# Altium schematic sheet Sheet1.SchDoc
size B; DocumentNumber: 1; SheetNumber: 1; SheetTotal: 3
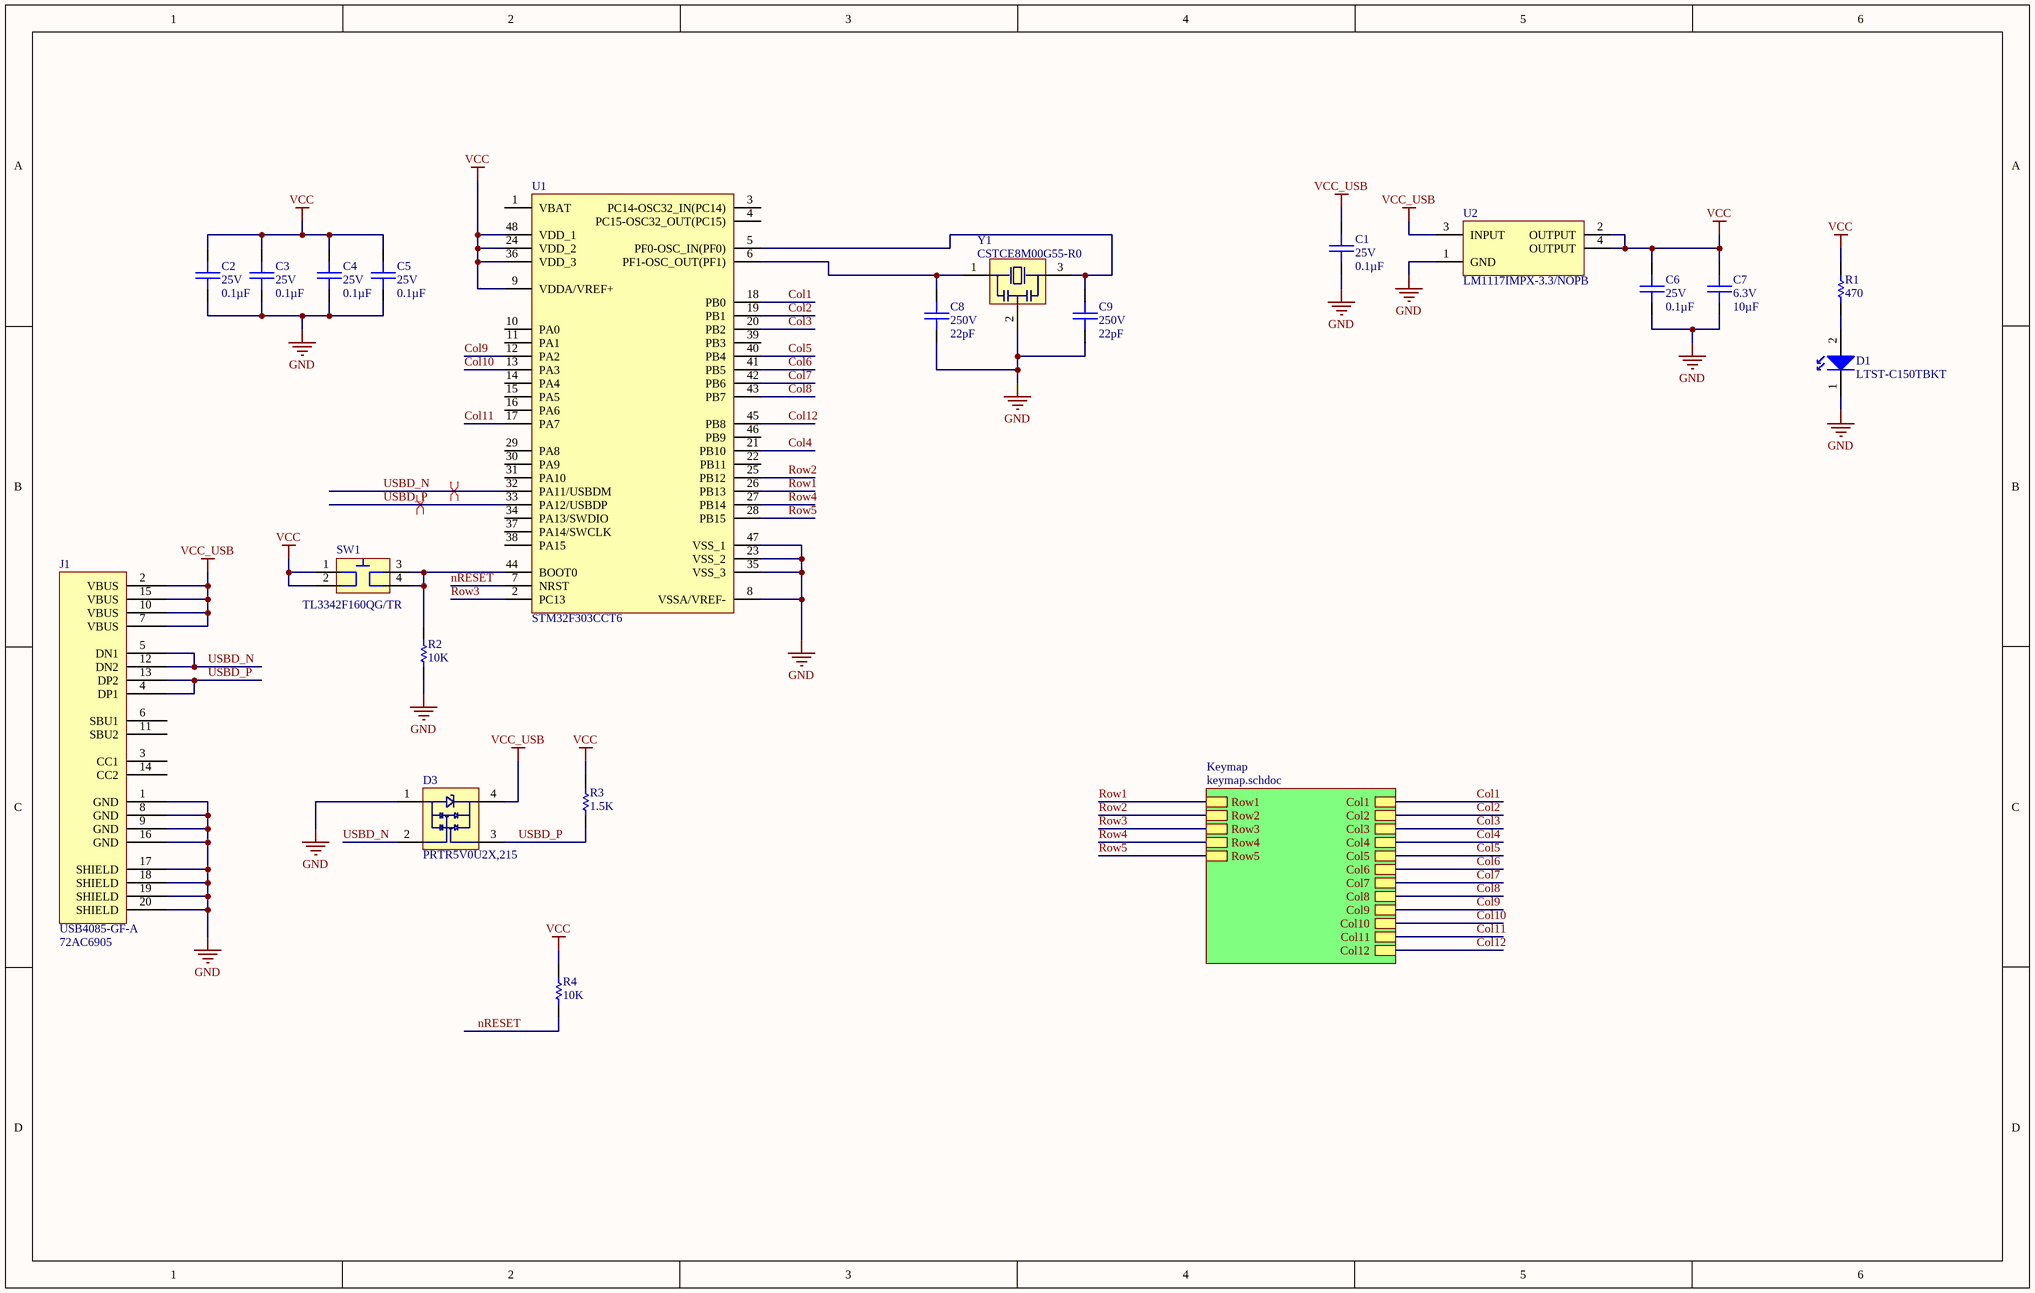
[diagram p0: Sheet1.SchDoc]

## Parts
C1  value 0.1µF  Voltage: 25V  [CAPC_0603(1.6X0.8)_N]  (hidden comment: Generic CAPC 0603 0.1µF 25V ±10% X7R)
C2  value 0.1µF  Voltage: 25V  [CAPC_0603(1.6X0.8)_N]  (hidden comment: Generic CAPC 0603 0.1µF 25V ±10% X7R)
C3  value 0.1µF  Voltage: 25V  [CAPC_0603(1.6X0.8)_N]  (hidden comment: Generic CAPC 0603 0.1µF 25V ±10% X7R)
C4  value 0.1µF  Voltage: 25V  [CAPC_0603(1.6X0.8)_N]  (hidden comment: Generic CAPC 0603 0.1µF 25V ±10% X7R)
C5  value 0.1µF  Voltage: 25V  [CAPC_0603(1.6X0.8)_N]  (hidden comment: Generic CAPC 0603 0.1µF 25V ±10% X7R)
C6  value 0.1µF  Voltage: 25V  [CAPC_0603(1.6X0.8)_N]  (hidden comment: Generic CAPC 0603 0.1µF 25V ±10% X7R)
C7  value 10µF  Voltage: 6.3V  [CAPC_0603(1.6X0.8)_N]  (hidden comment: Generic CAPC 0603 10µF 6.3V ±20% X5R)
C8  value 22pF  Voltage: 250V  [CAPC_0603(1.6X0.8)_N]  (hidden comment: Generic CAPC 0603 22pF 250V ±2% C0G/NP0)
C9  value 22pF  Voltage: 250V  [CAPC_0603(1.6X0.8)_N]  (hidden comment: Generic CAPC 0603 22pF 250V ±2% C0G/NP0)
D1  LED 468NM BLUE CLEAR 1206 SMD  [LTST-C150TBKT_N]  (value not drawn)
D3  TVS DIODE 5.5VWM SOT143B  [NXP_SOT143B_N]  (value not drawn)
J1  USB4085-GF-A  Supplier Part Number 1: 72AC6905  [GCT_USB4085-GF-A_MN]
R1  value 470  [RESC_0603(1.6X0.8)_N]  (hidden comment: Generic RES 0603 470 0.1W 5%)
R2  value 10K  [RESC_0603(1.6X0.8)_N]  (hidden comment: Generic RES 0603 10K 0.1W 5%)
R3  value 1.5K  [RESC_0603(1.6X0.8)_N]  (hidden comment: Generic RES 0603 1.5K 0.1W 5%)
R4  value 10K  [RESC_0603(1.6X0.8)_N]  (hidden comment: Generic RES 0603 10K 0.1W 5%)
SW1  Manufacturer Part Number: TL3342F160QG/TR  [TL3342F160QG-TR]  (hidden comment: SWITCH TACTILE SPST-NO 0.05A 12V)
U1  32BIT, CORTEX-M4, 72MHZ, LQFP-48  [ST_LQFP-48-7x7x1.4_MN]  (value not drawn)
U2  Manufacturer Part Number: LM1117IMPX-3.3/NOPB  [TI_DCY-R-PDSO-G4_N]  (hidden comment: IC REG LDO 3.3V 0.8A SOT223)
Y1  CER RESONATOR 8.00MHZ SMD  [CSTCE8M00G55-R0]  (value not drawn)

## Sub-sheets
Keymap = keymap.schdoc: Col3, Col7, Col10, Col1, Col9, Col11, Row5, Col2, Col4, Col12, Col5, Col6, Row1, Row3, Row2, Row4, Col8

## Nets
GND: C1.2 C2.2 C3.2 C4.2 C5.2 C6.2 C7.2 C8.2 C9.2 D1.1(K) D3.1(GND) J1.1(GND) J1.8(GND) J1.9(GND) J1.16(GND) J1.17(SHIELD) J1.18(SHIELD) J1.19(SHIELD) J1.20(SHIELD) R2.1 U1.8(VSSA/VREF-) U1.23(VSS_2) U1.35(VSS_3) U1.47(VSS_1) U2.1(GND) Y1.2
VCC: C2.1 C3.1 C4.1 C5.1 C6.1 C7.1 R1.2 R3.2 R4.2 SW1.1 SW1.2 U1.9(VDDA/VREF+) U1.24(VDD_2) U1.36(VDD_3) U1.48(VDD_1) U2.2(OUTPUT) U2.4(OUTPUT)
VCC_USB: C1.1 D3.4(VCC) J1.2(VBUS) J1.7(VBUS) J1.10(VBUS) J1.15(VBUS) U2.3(INPUT)
Col1: U1.18(PB0) ; sheet Keymap/Col1
Col2: U1.19(PB1) ; sheet Keymap/Col2
Col3: U1.20(PB2) ; sheet Keymap/Col3
Col4: U1.21(PB10) ; sheet Keymap/Col4
Col5: U1.40(PB4) ; sheet Keymap/Col5
Col6: U1.41(PB5) ; sheet Keymap/Col6
Col7: U1.42(PB6) ; sheet Keymap/Col7
Col8: U1.43(PB7) ; sheet Keymap/Col8
Col9: U1.12(PA2) ; sheet Keymap/Col9
Col10: U1.13(PA3) ; sheet Keymap/Col10
Col11: U1.17(PA7) ; sheet Keymap/Col11
Col12: U1.45(PB8) ; sheet Keymap/Col12
nRESET: R4.1 U1.7(NRST)
Row1: U1.26(PB13) ; sheet Keymap/Row1
Row2: U1.25(PB12) ; sheet Keymap/Row2
Row3: U1.2(PC13) ; sheet Keymap/Row3
Row4: U1.27(PB14) ; sheet Keymap/Row4
Row5: U1.28(PB15) ; sheet Keymap/Row5
USBD_N: D3.2(IO1) J1.5(DN1) J1.12(DN2) U1.32(PA11/USBDM)
USBD_P: D3.3(IO2) J1.4(DP1) J1.13(DP2) R3.1 U1.33(PA12/USBDP)
NetC8_1: C8.1 U1.6(PF1-OSC_OUT(PF1)) Y1.1
NetC9_1: C9.1 U1.5(PF0-OSC_IN(PF0)) Y1.3
NetD1_2: D1.2(A) R1.1
NetR2_2: R2.2 SW1.3 SW1.4 U1.44(BOOT0)

Not connected (* = marked no-connect by the designer): J1 3(CC1) 6(SBU1) 11(SBU2) 14(CC2); U1 1(VBAT) 3(PC14-OSC32_IN(PC14)) 4(PC15-OSC32_OUT(PC15)) 10(PA0) 11(PA1) 14(PA4) 15(PA5) 16(PA6) 22(PB11) 29(PA8) 30(PA9) 31(PA10) 34(PA13/SWDIO) 37(PA14/SWCLK) 38(PA15) 39(PB3) 46(PB9)

## Layout directives
differential pair: USBD_N, USBD_P

## Library data of the parts
C1-C6 = SFE-CAPC-0603-0.1µF-25V-±10%-X7R: Generic Capacitor; Case-IEC: 0603; capacitance: 0.0000001; Case-Metric: *; Tolerance: ±10%; DesignID: SFE-CAPC-0603-0.1µF-25V-±10%-X7R; Manufacturer: Generic; Manufacturer Part Number: SFE-CAPC-0603-0.1µF-25V-±10%-X7R
C7 = SFE-CAPC-0603-10µF-6.3V-±20%-X5R: Generic Capacitor; Case-IEC: 0603; capacitance: 0.00001; Case-Metric: *; Tolerance: ±20%; DesignID: SFE-CAPC-0603-10µF-6.3V-±20%-X5R; Manufacturer: Generic; Manufacturer Part Number: SFE-CAPC-0603-10µF-6.3V-±20%-X5R
C8 C9 = SFE-CAPC-0603-22pF-250V-±2%-C0G/NP0: Generic Capacitor; Case-IEC: 0603; capacitance: 0.000000000022; Case-Metric: *; Tolerance: ±2%; DesignID: SFE-CAPC-0603-22pF-250V-±2%-C0G/NP0; Manufacturer: Generic; Manufacturer Part Number: SFE-CAPC-0603-22pF-250V-±2%-C0G/NP0
D1 = LTST-C150TBKT: Manufacturer: Lite-On Inc; SafariPartNumber: 15 25012RC; Wavelength - Dominant: 470nm; Millicandela Rating: 104mcd; Voltage - Forward (Vf) (Typ): 3.3V; Current - Test: 20mA; Viewing Angle: 130°; Lens Style/Size: Rectangle with Flat Top, 2.06mm x 1.6mm; Supplier 1: Digi-Key; Supplier Part Number 1: 160-1643-1-ND; RoHS: RoHS Compliant; Category: Optoelectronics; Stock 1: 267579; Pricing 1: 1=0.5, 10=0.369, 100=0.1956, 250=0.13836, 500=0.11808, 1000=0.09225 (USD); Packaging: Cut Tape (CT); Color: Blue; Wavelength - Peak: 468nm; Lens Type: Clear; Package / Case: 1206 (3216 Metric); Size / Dimension: 3.20mm L x 1.60mm W; Height: 1.10mm; Mounting Type: Surface Mount; Luminous Flux @ Current - Test: -; ComponentLink1URL: http://optoelectronics.liteon.com/upload/download/DS22-2000-026/S_110_LTST-C150TBKT(0630).pdf; ComponentLink1Description: http://optoelectronics.liteon.com/upload/download/DS22-2000-026/S_110_LTST-C150TBKT(0630).pdf; Manufacturer Part Number: LTST-C150TBKT; DesignID: LTST-C150TBKT
D3 = PRTR5V0U2X,215: Manufacturer: NXP Semiconductors; SafariPartNumber: 15 27314RC; Type: Steering (Rail to Rail); Bidirectional Channels: 2; Voltage - Reverse Standoff (Typ): 5.5V (Max); Voltage - Breakdown (Min): 6V; Power Line Protection: Yes; Capacitance @ Frequency: 1pF @ 1MHz; Supplier 1: Digi-Key; Supplier Part Number 1: 568-4140-1-ND; RoHS: RoHS Compliant; Category: Circuit Protection; Stock 1: 19762; Pricing 1: 1=0.57, 10=0.477, 25=0.418, 100=0.3578, 250=0.31036, 500=0.26286, 1000=0.20265 (USD); Packaging: Cut Tape (CT); Unidirectional Channels: -; Voltage - Clamping (Max) @ Ipp: -; Current - Peak Pulse (10/1000µs): -; Power - Peak Pulse: -; Applications: General Purpose; Operating Temperature: -40°C ~ 85°C (TA); Mounting Type: Surface Mount; Package / Case: TO-253-4, TO-253AA; Supplier Device Package: SOT-143B; ComponentLink1URL: https://assets.nexperia.com/documents/data-sheet/PRTR5V0U2X.pdf; ComponentLink1Description: Datasheet; Manufacturer Part Number: PRTR5V0U2X,215; DesignID: PRTR5V0U2X,215
J1 = USB4085-GF-A: USB4085 Series 20 V PCB Top Mount USB 2.0 Type C Receptacle; Manufacturer 1: Global Connector Technology; USB Standard: USB 2.0; Number of Positions: 16; Supplier 1: Newark; Manufacturer Part Number 1: USB4085-GF-A; RoHS: No; Pricing 1: 1=1.38000, 10=1.23000, 25=1.15000, 50=1.06000, 100=0.91100, 250=0.83700, 700=0.77300, 1400=0.72600 (USD); Contact Material: Copper Alloy; Contact Plating: Gold; Gender: Receptacle; Orientation: Right Angle; ComponentLink1URL: https://datasheet.ciiva.com/71788/2674755-71788146.pdf?src-supplier=Element14; ComponentLink1Description: https://datasheet.ciiva.com/71788/2674755-71788146.pdf?src-supplier=Element14; ComponentLink2URL: https://datasheet.ciiva.com/71788/usb4085-71788147.pdf?src-supplier=Digi-Key; ComponentLink2Description: https://datasheet.ciiva.com/71788/usb4085-71788147.pdf?src-supplier=Digi-Key
R1 = SFE-RES-0603-470-0.1W-5%: Generic Resistor; Temperature Coefficient: PPM; Case-IEC: 0603; ValueString: 4705%; Tolerance: 5%; Power: 0.1W; DesignID: SFE-RES-0603-470-0.1W-5%; Manufacturer: Generic; Manufacturer Part Number: SFE-RES-0603-470-0.1W-5%; Resistance: 470
R2 R4 = SFE-RES-0603-10K-0.1W-5%: Generic Resistor; Temperature Coefficient: PPM; Case-IEC: 0603; ValueString: 10K5%; Resistance: 10000; Tolerance: 5%; Power: 0.1W; DesignID: SFE-RES-0603-10K-0.1W-5%; Manufacturer: Generic; Manufacturer Part Number: SFE-RES-0603-10K-0.1W-5%
R3 = SFE-RES-0603-1.5K-0.1W-5%: Generic Resistor; Temperature Coefficient: PPM; Case-IEC: 0603; ValueString: 1.5K5%; Resistance: 1500; Tolerance: 5%; Power: 0.1W; DesignID: SFE-RES-0603-1.5K-0.1W-5%; Manufacturer: Generic; Manufacturer Part Number: SFE-RES-0603-1.5K-0.1W-5%
SW1 = TL3342F160QG/TR: Manufacturer: E-Switch; Switch Function: Off-Mom; Contact Rating @ Voltage: 0.05A @ 12VDC; Actuator Type: Standard; Actuator Height off PCB, from Pins: 1.54mm; Actuator Orientation: Top Actuated; Outline: 4.90mm x 4.90mm; Illumination: Non-Illuminated; Operating Force: 160gf; Actuator Material: Polyphenylene Sulfide (PPS); Mechanical Life: 100,000 Cycles; Supplier 1: Digi-Key; Supplier Part Number 1: EG2531CT-ND; RoHS: RoHS Compliant; Category: Switches; Stock 1: 54320; Pricing 1: 1=0.63, 10=0.603, 25=0.5916, 50=0.5694, 100=0.4913, 250=0.4466, 500=0.42428, 1000=0.33495 (USD); Packaging: Cut Tape (CT); Circuit: SPST-NO; Mounting Type: Surface Mount; Termination Style: Gull Wing; Illumination Voltage (Nominal): -; Illumination Type, Color: -; Ingress Protection: -; Features: -; Switch Travel: -; Operating Temperature: -; ComponentLink1URL: https://www.e-switch.com/system/asset/product_line/data_sheet/165/TL3342.pdf; ComponentLink1Description: https://www.e-switch.com/system/asset/product_line/data_sheet/165/TL3342.pdf; DesignID: TL3342F160QG/TR
U1 = STM32F303CCT6: Manufacturer 1: STMicroelectronics; Manufacturer: ST Micro; Number of I/Os: 37; Interface: I2C,SPI,USB,CAN,IrDA,UART,USART,LIN,I2S; RAM Size: 40KB; Number of Timers/Counters: 10; Oscillator Type: Internal; Number of Programmable I/O: 27; Data Bus Width: 32b; Watchdog Timer: Yes; Memory Type: FLASH; Memory Size: 256KB; Peripherals: POR,PWM,WDT,DMA; Core Architecture: ARM; Max Supply Voltage: 3.6V; Min Supply Voltage: 2V; Number of ADC Channels: 39; Number of SPI Channels: 3; Number of I2C Channels: 2; Number of USB Channels: 1; Supplier 1: Digi-Key; Stock 1: 5656; Pricing 1: 1=5.94000, 10=5.33600, 100=4.37190, 500=3.72172, 1000=3.13880 (USD); RoHS: Yes; Case/Package: LQFP; Number of Pins: 48; Contact Plating: Gold; Min Operating Temperature: -40°C; Max Operating Temperature: 85°C; Frequency: 72MHz; Packaging: Tray; Max Frequency: 72MHz; Package Quantity: 250; Length: 10mm; Height: 1.45mm; Width: 7.2mm; Radiation Hardening: No; Lead Free: Lead Free; REACH SVHC: No SVHC; ComponentLink1URL: https://datasheet.ciiva.com/14666/0900766b81171360-14666656.pdf?src-supplier=RSComponents; ComponentLink1Description: https://datasheet.ciiva.com/14666/0900766b81171360-14666656.pdf?src-supplier=RSComponents; ComponentLink2URL: https://datasheet.ciiva.com/8055/1831499-8055015.pdf?src-supplier=Element14; ComponentLink2Description: https://datasheet.ciiva.com/8055/1831499-8055015.pdf?src-supplier=Element14; Supplier Part Number 1: 497-13318-ND; Manufacturer Part Number 1: STM32F303CCT6; DesignID: STM32F303CCT6; Manufacturer Part Number: STM32F303CCT6
U2 = LM1117IMPX-3.3/NOPB: Manufacturer: Texas Instruments; SafariPartNumber: 15 24656RC; Regulator Topology: Positive Fixed; Current - Output: 800mA; Voltage - Dropout (Typical): 1.2V @ 800mA; Number of Regulators: 1; Voltage - Input: Up to 15V; Supplier 1: Digi-Key; Supplier Part Number 1: LM1117IMPX-3.3/NOPBCT-ND; RoHS: RoHS Compliant; Category: Integrated Circuits (ICs); Stock 1: 19906; Pricing 1: 1=1.04, 10=0.927, 100=0.7229, 500=0.5978, 1000=0.47275 (USD); Packaging: Cut Tape (CT); Voltage - Output: 3.3V; Current - Limit (Min): 800mA; Operating Temperature: -40°C ~ 125°C; Mounting Type: Surface Mount; Package / Case: TO-261-4, TO-261AA; Supplier Device Package: SOT-223-4; ComponentLink1URL: http://www.ti.com/lit/ds/symlink/lm1117.pdf; ComponentLink1Description: http://www.ti.com/lit/ds/symlink/lm1117.pdf; Supplier 2: Mouser; Supplier Part Number 2: 926-LM1117IMPX33NOPB; Supplier 3: Newark; Supplier Part Number 3: 28X3413; DesignID: LM1117IMPX-3.3/NOPB
Y1 = CSTCE8M00G55-R0: Manufacturer: Murata Electronics North America; Frequency: 8MHz; Frequency Stability: ±0.2%; Frequency Tolerance: ±0.5%; Capacitance: 33pF; Supplier 1: Digi-Key; Supplier Part Number 1: 490-1195-1-ND; RoHS: RoHS Compliant; Category: Crystals and Oscillators; Stock 1: 11412; Pricing 1: 1=0.46, 10=0.384, 50=0.3456, 100=0.3074, 500=0.29134, 1000=0.24595 (USD); Packaging: Cut Tape (CT); Type: Ceramic; Features: Built in Capacitor; Impedance: -; Operating Temperature: -20°C ~ 80°C; Mounting Type: Surface Mount; Package / Case: 3-SMD, Non-Standard; Size / Dimension: 0.126" L x 0.051" W (3.20mm x 1.30mm); Height: 0.031" (0.80mm); ComponentLink1URL: http://www.murata.com/~/media/webrenewal/support/library/catalog/products/timingdevice/ceralock/p16e.ashx; ComponentLink1Description: http://www.murata.com/~/media/webrenewal/support/library/catalog/products/timingdevice/ceralock/p16e.ashx; Manufacturer Part Number: CSTCE8M00G55-R0; DesignID: CSTCE8M00G55-R0